# EAGLE design 8_output_sense_mux_half (EAGLE 6.5.0)
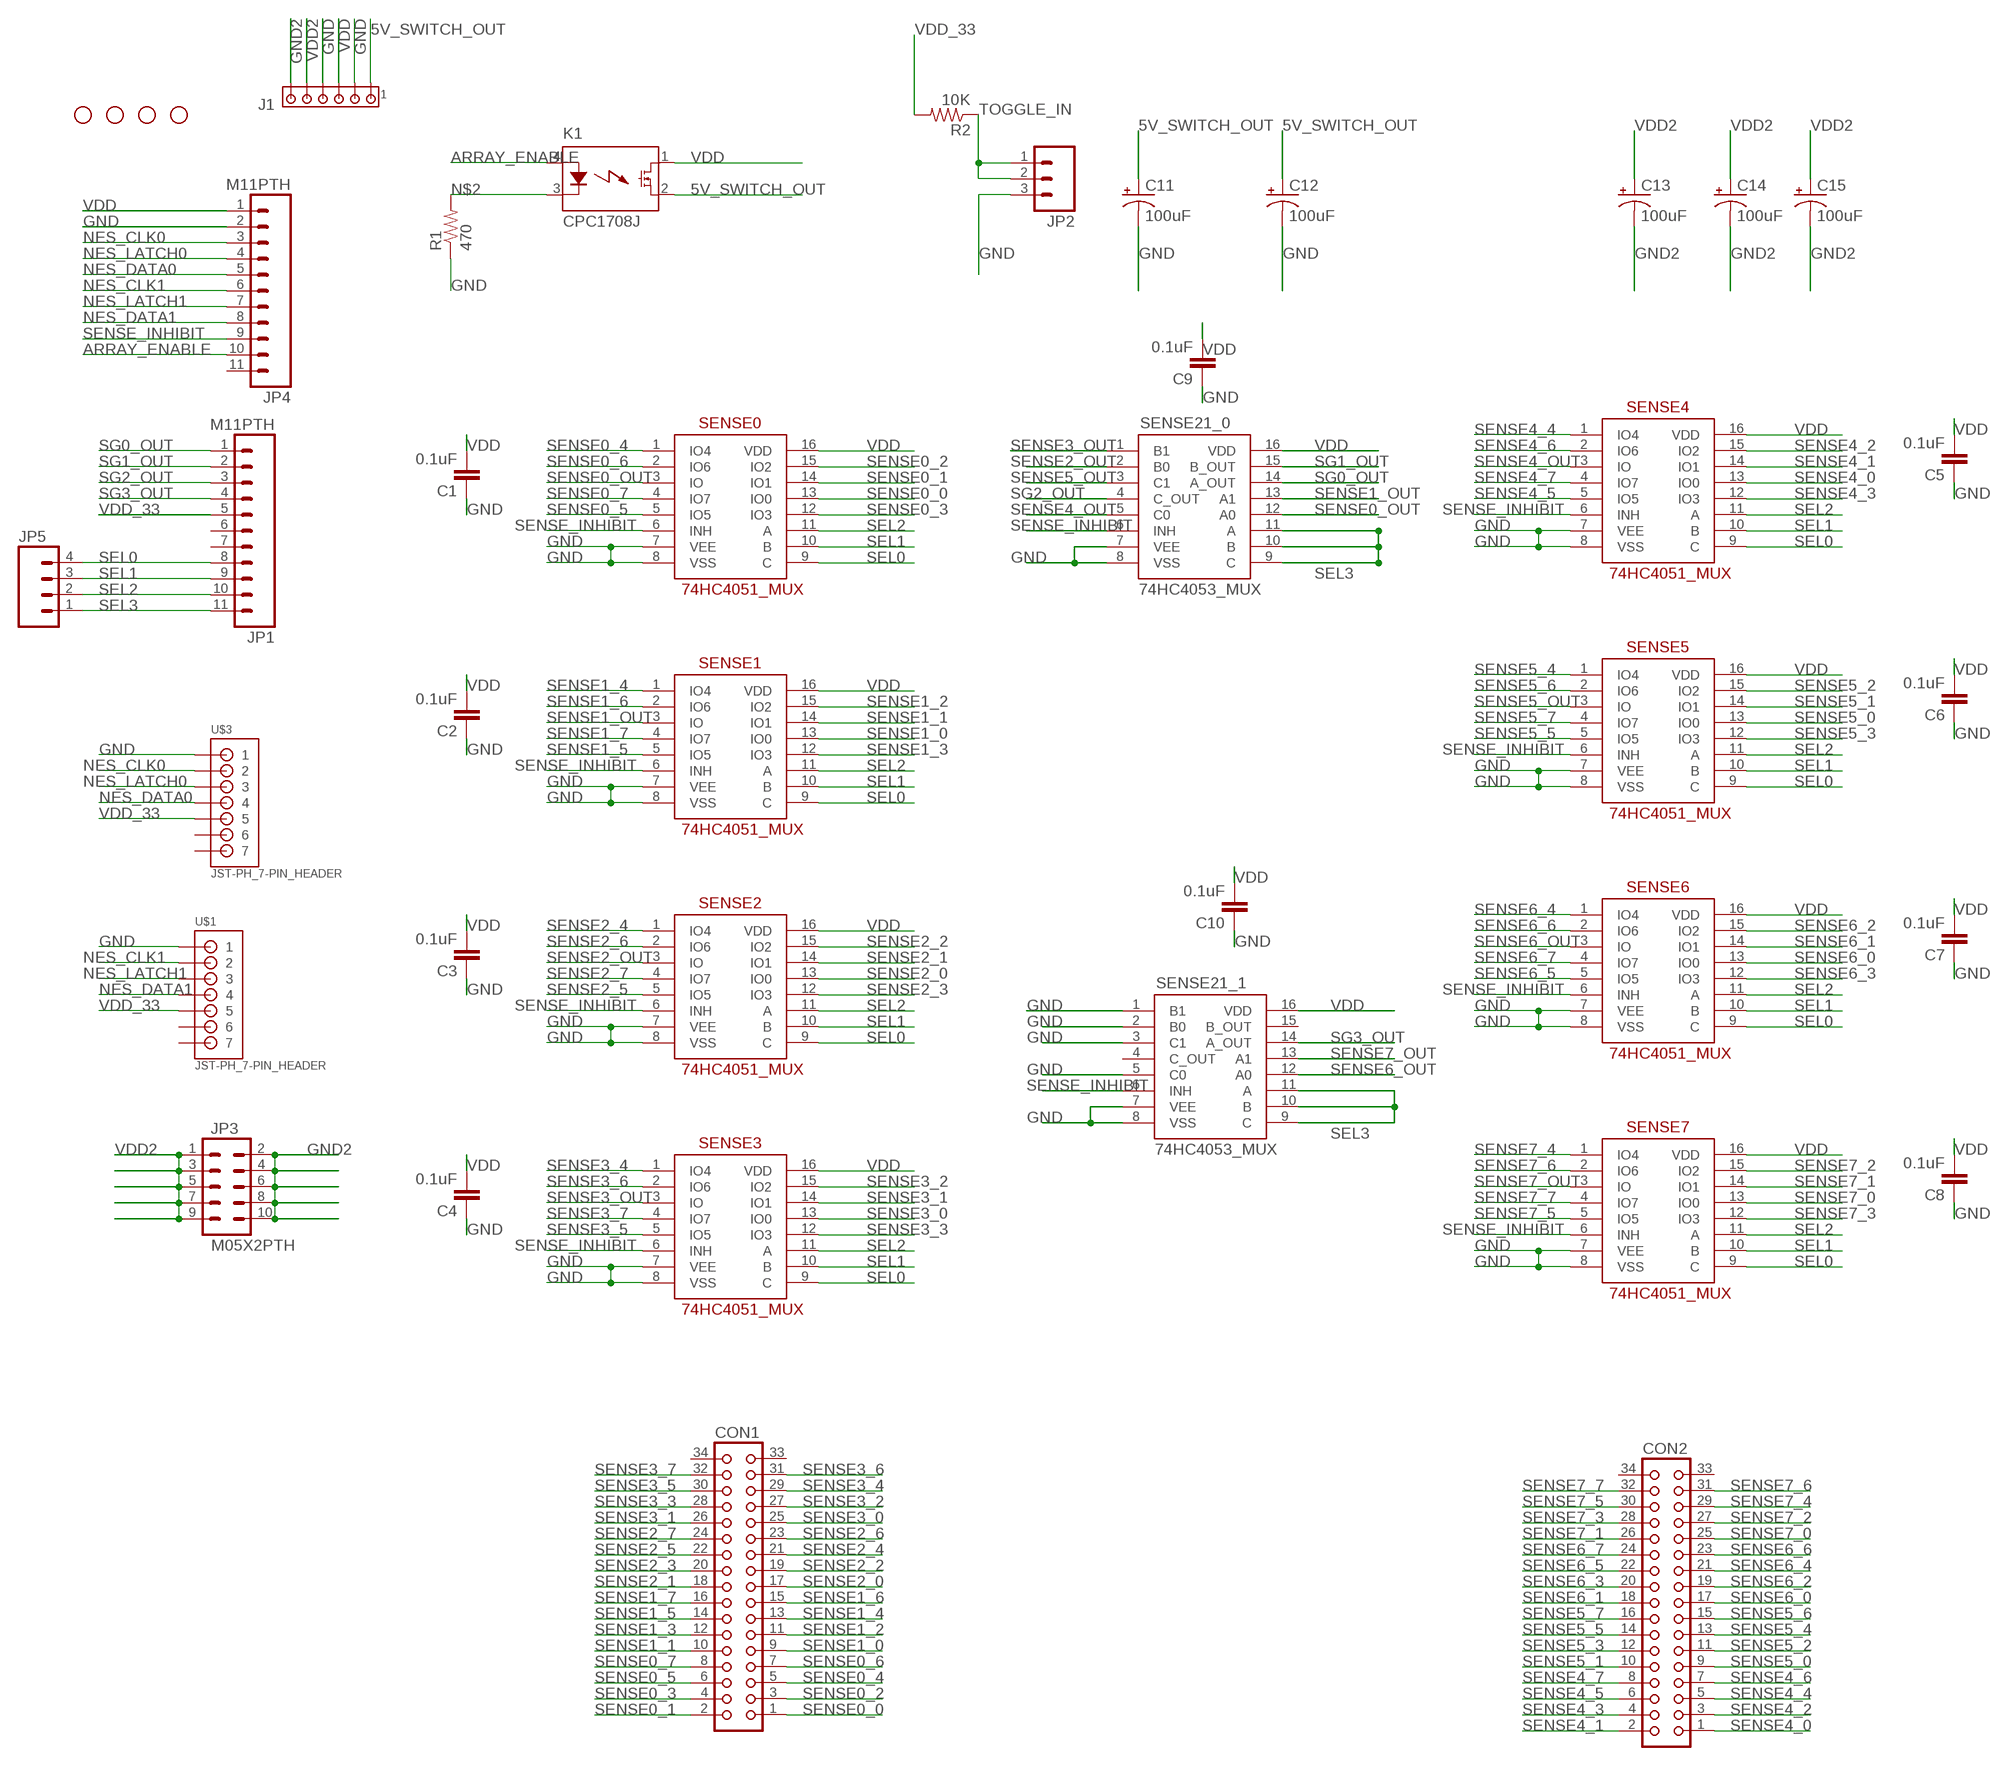
[diagram p0: schematic, sheet 1]

## Parts
C1  0.1uF  C2,5-3  [C2.5-3]
C2  0.1uF  C2,5-3  [C2.5-3]
C3  0.1uF  C2,5-3  [C2.5-3]
C4  0.1uF  C2,5-3  [C2.5-3]
C5  0.1uF  C2,5-3  [C2.5-3]
C6  0.1uF  C2,5-3  [C2.5-3]
C7  0.1uF  C2,5-3  [C2.5-3]
C8  0.1uF  C2,5-3  [C2.5-3]
C9  0.1uF  C2,5-3  [C2.5-3]
C10  0.1uF  C2,5-3  [C2.5-3]
C11  100uF  CAP_POLPTH1  [CPOL-RADIAL-100UF-25V]
C12  100uF  CAP_POLPTH1  [CPOL-RADIAL-100UF-25V]
C13  100uF  CAP_POLPTH1  [CPOL-RADIAL-100UF-25V]
C14  100uF  CAP_POLPTH1  [CPOL-RADIAL-100UF-25V]
C15  100uF  CAP_POLPTH1  [CPOL-RADIAL-100UF-25V]
CON1  CON34  [CON34]
CON2  CON34  [CON34]
J1  MTA06-156  [1X6MTA]
JP1  M11PTH  [1X11]
JP2  M03PTH  [1X03]
JP3  M05X2PTH  [AVR_ICSP]
JP4  M11PTH  [1X11]
JP5  M04PTH  [1X04]
K1  CPC1708J  [I4-PAC]
R1  470  10KOHM1/6W5%(PTH)KIT  [AXIAL-0.3-KIT]
R2  10K  10KOHM1/6W5%(PTH)KIT  [AXIAL-0.3-KIT]
SENSE0  74HC4051_MUX  [DIL16]
SENSE1  74HC4051_MUX  [DIL16]
SENSE2  74HC4051_MUX  [DIL16]
SENSE3  74HC4051_MUX  [DIL16]
SENSE4  74HC4051_MUX  [DIL16]
SENSE5  74HC4051_MUX  [DIL16]
SENSE6  74HC4051_MUX  [DIL16]
SENSE7  74HC4051_MUX  [DIL16]
SENSE21_0  74HC4053_MUX  [DIL16]
SENSE21_1  74HC4053_MUX  [DIL16]
STANDOFF1  STAND-OFF  [STAND-OFF]
STANDOFF2  STAND-OFF  [STAND-OFF]
STANDOFF3  STAND-OFF  [STAND-OFF]
STANDOFF4  STAND-OFF  [STAND-OFF]
U$1  JST-PH_7-PIN_HEADER  [JST_B7B-PH_HEADER]
U$3  JST-PH_7-PIN_HEADER  [JST_B7B-PH_HEADER]

## Nets
5V_SWITCH_OUT [PWR/GND]: C11.1(+) C12.1(+) J1.1 K1.2(DS2)
ARRAY_ENABLE: JP4.10 K1.4(A)
GND [PWR/GND]: C1.1 C2.1 C3.1 C4.1 C5.1 C6.1 C7.1 C8.1 C9.1 C10.1 C11.2(-) C12.2(-) J1.2 J1.4 JP2.3 JP4.2 R1.P$1 SENSE0.7(VEE) SENSE0.8(VSS) SENSE1.7(VEE) SENSE1.8(VSS) SENSE2.7(VEE) SENSE2.8(VSS) SENSE3.7(VEE) SENSE3.8(VSS) SENSE4.7(VEE) SENSE4.8(VSS) SENSE5.7(VEE) SENSE5.8(VSS) SENSE6.7(VEE) SENSE6.8(VSS) SENSE7.7(VEE) SENSE7.8(VSS) SENSE21_0.7(VEE) SENSE21_0.8(VSS) SENSE21_1.1(B1) SENSE21_1.2(B0) SENSE21_1.3(C1) SENSE21_1.5(C0) SENSE21_1.7(VEE) SENSE21_1.8(VSS) U$1.P1 U$3.P1
GND2 [PWR2]: C13.2(-) C14.2(-) C15.2(-) J1.6 JP3.2 JP3.4 JP3.6 JP3.8 JP3.10
N$2: K1.3(K) R1.P$2
NES_CLK0: JP4.3 U$3.P2
NES_CLK1: JP4.6 U$1.P2
NES_DATA0: JP4.5 U$3.P4
NES_DATA1: JP4.8 U$1.P4
NES_LATCH0: JP4.4 U$3.P3
NES_LATCH1: JP4.7 U$1.P3
SEL0: JP1.8 JP5.4 SENSE0.9(C) SENSE1.9(C) SENSE2.9(C) SENSE3.9(C) SENSE4.9(C) SENSE5.9(C) SENSE6.9(C) SENSE7.9(C)
SEL1: JP1.9 JP5.3 SENSE0.10(B) SENSE1.10(B) SENSE2.10(B) SENSE3.10(B) SENSE4.10(B) SENSE5.10(B) SENSE6.10(B) SENSE7.10(B)
SEL2: JP1.10 JP5.2 SENSE0.11(A) SENSE1.11(A) SENSE2.11(A) SENSE3.11(A) SENSE4.11(A) SENSE5.11(A) SENSE6.11(A) SENSE7.11(A)
SEL3: JP1.11 JP5.1 SENSE21_0.9(C) SENSE21_0.10(B) SENSE21_0.11(A) SENSE21_1.9(C) SENSE21_1.10(B) SENSE21_1.11(A)
SENSE0_0: CON1.1 SENSE0.13(IO0)
SENSE0_1: CON1.2 SENSE0.14(IO1)
SENSE0_2: CON1.3 SENSE0.15(IO2)
SENSE0_3: CON1.4 SENSE0.12(IO3)
SENSE0_4: CON1.5 SENSE0.1(IO4)
SENSE0_5: CON1.6 SENSE0.5(IO5)
SENSE0_6: CON1.7 SENSE0.2(IO6)
SENSE0_7: CON1.8 SENSE0.4(IO7)
SENSE0_OUT: SENSE0.3(IO) SENSE21_0.12(A0)
SENSE1_0: CON1.9 SENSE1.13(IO0)
SENSE1_1: CON1.10 SENSE1.14(IO1)
SENSE1_2: CON1.11 SENSE1.15(IO2)
SENSE1_3: CON1.12 SENSE1.12(IO3)
SENSE1_4: CON1.13 SENSE1.1(IO4)
SENSE1_5: CON1.14 SENSE1.5(IO5)
SENSE1_6: CON1.15 SENSE1.2(IO6)
SENSE1_7: CON1.16 SENSE1.4(IO7)
SENSE1_OUT: SENSE1.3(IO) SENSE21_0.13(A1)
SENSE2_0: CON1.17 SENSE2.13(IO0)
SENSE2_1: CON1.18 SENSE2.14(IO1)
SENSE2_2: CON1.19 SENSE2.15(IO2)
SENSE2_3: CON1.20 SENSE2.12(IO3)
SENSE2_4: CON1.21 SENSE2.1(IO4)
SENSE2_5: CON1.22 SENSE2.5(IO5)
SENSE2_6: CON1.23 SENSE2.2(IO6)
SENSE2_7: CON1.24 SENSE2.4(IO7)
SENSE2_OUT: SENSE2.3(IO) SENSE21_0.2(B0)
SENSE3_0: CON1.25 SENSE3.13(IO0)
SENSE3_1: CON1.26 SENSE3.14(IO1)
SENSE3_2: CON1.27 SENSE3.15(IO2)
SENSE3_3: CON1.28 SENSE3.12(IO3)
SENSE3_4: CON1.29 SENSE3.1(IO4)
SENSE3_5: CON1.30 SENSE3.5(IO5)
SENSE3_6: CON1.31 SENSE3.2(IO6)
SENSE3_7: CON1.32 SENSE3.4(IO7)
SENSE3_OUT: SENSE3.3(IO) SENSE21_0.1(B1)
SENSE4_0: CON2.1 SENSE4.13(IO0)
SENSE4_1: CON2.2 SENSE4.14(IO1)
SENSE4_2: CON2.3 SENSE4.15(IO2)
SENSE4_3: CON2.4 SENSE4.12(IO3)
SENSE4_4: CON2.5 SENSE4.1(IO4)
SENSE4_5: CON2.6 SENSE4.5(IO5)
SENSE4_6: CON2.7 SENSE4.2(IO6)
SENSE4_7: CON2.8 SENSE4.4(IO7)
SENSE4_OUT: SENSE4.3(IO) SENSE21_0.5(C0)
SENSE5_0: CON2.9 SENSE5.13(IO0)
SENSE5_1: CON2.10 SENSE5.14(IO1)
SENSE5_2: CON2.11 SENSE5.15(IO2)
SENSE5_3: CON2.12 SENSE5.12(IO3)
SENSE5_4: CON2.13 SENSE5.1(IO4)
SENSE5_5: CON2.14 SENSE5.5(IO5)
SENSE5_6: CON2.15 SENSE5.2(IO6)
SENSE5_7: CON2.16 SENSE5.4(IO7)
SENSE5_OUT: SENSE5.3(IO) SENSE21_0.3(C1)
SENSE6_0: CON2.17 SENSE6.13(IO0)
SENSE6_1: CON2.18 SENSE6.14(IO1)
SENSE6_2: CON2.19 SENSE6.15(IO2)
SENSE6_3: CON2.20 SENSE6.12(IO3)
SENSE6_4: CON2.21 SENSE6.1(IO4)
SENSE6_5: CON2.22 SENSE6.5(IO5)
SENSE6_6: CON2.23 SENSE6.2(IO6)
SENSE6_7: CON2.24 SENSE6.4(IO7)
SENSE6_OUT: SENSE6.3(IO) SENSE21_1.12(A0)
SENSE7_0: CON2.25 SENSE7.13(IO0)
SENSE7_1: CON2.26 SENSE7.14(IO1)
SENSE7_2: CON2.27 SENSE7.15(IO2)
SENSE7_3: CON2.28 SENSE7.12(IO3)
SENSE7_4: CON2.29 SENSE7.1(IO4)
SENSE7_5: CON2.30 SENSE7.5(IO5)
SENSE7_6: CON2.31 SENSE7.2(IO6)
SENSE7_7: CON2.32 SENSE7.4(IO7)
SENSE7_OUT: SENSE7.3(IO) SENSE21_1.13(A1)
SENSE_INHIBIT: JP4.9 SENSE0.6(INH) SENSE1.6(INH) SENSE2.6(INH) SENSE3.6(INH) SENSE4.6(INH) SENSE5.6(INH) SENSE6.6(INH) SENSE7.6(INH) SENSE21_0.6(INH) SENSE21_1.6(INH)
SG0_OUT: JP1.1 SENSE21_0.14(A_OUT)
SG1_OUT: JP1.2 SENSE21_0.15(B_OUT)
SG2_OUT: JP1.3 SENSE21_0.4(C_OUT)
SG3_OUT: JP1.4 SENSE21_1.14(A_OUT)
TOGGLE_IN: JP2.1 JP2.2 R2.P$1
VDD [PWR/GND]: C1.2 C2.2 C3.2 C4.2 C5.2 C6.2 C7.2 C8.2 C9.2 C10.2 J1.3 JP4.1 K1.1(DS1) SENSE0.16(VDD) SENSE1.16(VDD) SENSE2.16(VDD) SENSE3.16(VDD) SENSE4.16(VDD) SENSE5.16(VDD) SENSE6.16(VDD) SENSE7.16(VDD) SENSE21_0.16(VDD) SENSE21_1.16(VDD)
VDD2 [PWR2]: C13.1(+) C14.1(+) C15.1(+) J1.5 JP3.1 JP3.3 JP3.5 JP3.7 JP3.9
VDD_33 [PWR/GND]: JP1.5 R2.P$2 U$1.P5 U$3.P5
Unconnected: CON1.33 CON1.34 CON2.33 CON2.34 JP1.6 JP1.7 JP4.11 SENSE21_1.4(C_OUT) SENSE21_1.15(B_OUT) U$1.P6 U$1.P7 U$3.P6 U$3.P7

## Library data of the parts
C1-C10 = capacitor-wima:C: CAPACITOR naming: grid - package width
C11-C15 = SparkFun-Capacitors:CAP_POL: Capacitor Polarized These are standard SMD and PTH capacitors. Normally 10uF, 47uF, and 100uF in electrolytic and tantalum varieties. Always verify the external diameter of the through hole cap, it varies with capacity, voltage, and manufacturer. The EIA devices should be standard.
CON1 CON2 = con-harting:CON34: CONNECTOR; OC_FARNELL: unknown; OC_NEWARK: unknown
J1 = con-amp:MTA06-156: AMP connector
JP1 JP4 = SparkFun-Connectors:M11: Header 11 Standard 11-pin 0.1" header. Use with straight break away headers (SKU : PRT-00116), right angle break away headers (PRT-00553), swiss pins (PRT-00743), machine pins (PRT-00117), and female headers (PRT-00115).
JP2 = SparkFun-Connectors:M03: Header 3 Standard 3-pin 0.1" header. Use with straight break away headers (SKU : PRT-00116), right angle break away headers (PRT-00553), swiss pins (PRT-00743), machine pins (PRT-00117), and female headers (PRT-00115). Molex polarized connector foot print use with SKU : PRT-08232 with associated crimp pins and housings.
JP3 = SparkFun-Connectors:M05X2: Header 5x2 Standard 10-pin dual row 0.1" header. Commonly used with AVR-ISP. Use with Spark Fun Electronics SKU: PRT-00778
JP5 = SparkFun-Connectors:M04: Header 4 Standard 4-pin 0.1" header. Use with straight break away headers (SKU : PRT-00116), right angle break away headers (PRT-00553), swiss pins (PRT-00743), machine pins (PRT-00117), and female headers (PRT-00115). Molex polarized connector foot print use with SKU : PRT-08231 with associated crimp pins and housings. 1MM SMD Version SKU: PRT-10208
K1 = relay:CPC1708J: Single-Pole, Normally Open i4-PAC (TM) DC Power Relay Source: Data sheet <http://www.clare.com/home/pdfs.nsf/www/CPC1708.pdf/$file/CPC1708.pdf>
R1 R2 = SparkFun-Resistors:10KOHM1/6W5%(PTH): RES-08375; PROD_ID: RES-08375
SENSE0 SENSE1-SENSE7 = MBI:74HC4051_MUX: 8:1 analog mux
SENSE21_0 SENSE21_1 = MBI:74HC4053_MUX: 3 channel 2:1 analog mux
STANDOFF1-STANDOFF4 = SparkFun-Electromechanical:STAND-OFF: #4 Stand Off This is the mechanical footprint for a #4 phillips button head screw. Use the keepout ring to avoid running the screw head into surrounding components. SKU : PRT-00447
U$1 U$3 = SJH:JST-PH_7-PIN_HEADER: 7-pin JST PH Shrouded Header top entry P/N B7B-PH-K-S Mating connector PHR-7

## Net classes
1 PWR/GND: width 0.61 mm
2 PWR2: width 0.813 mm

## Board
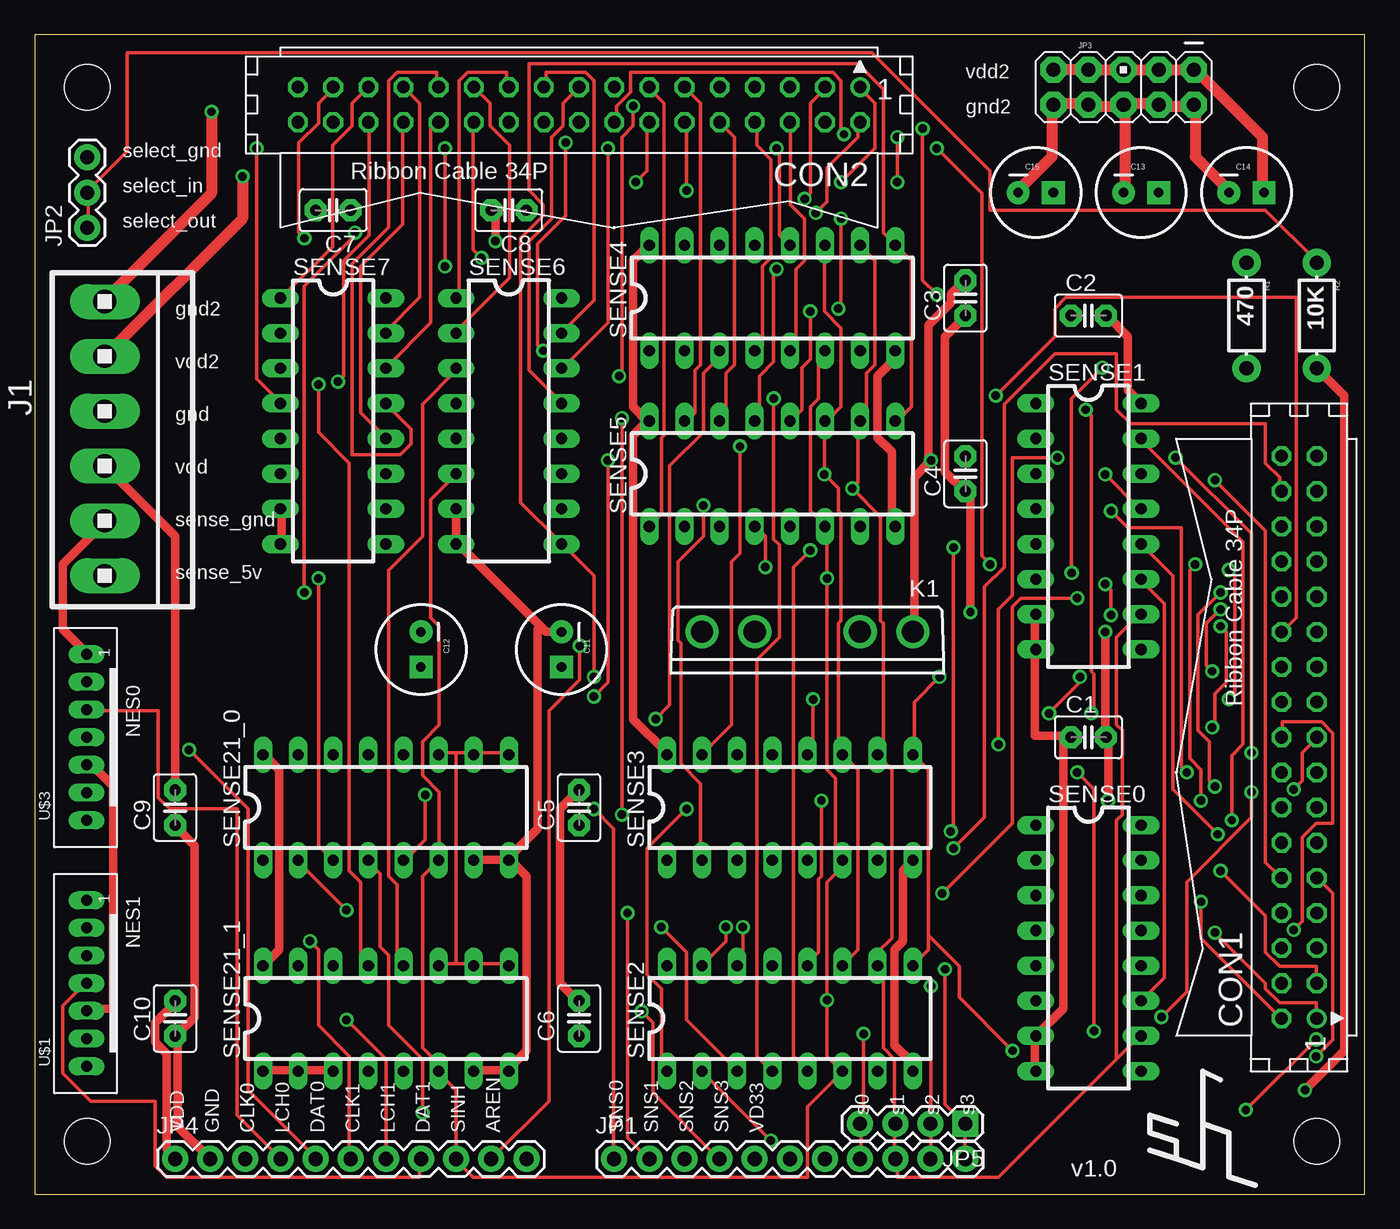
[diagram p1: board, top side]
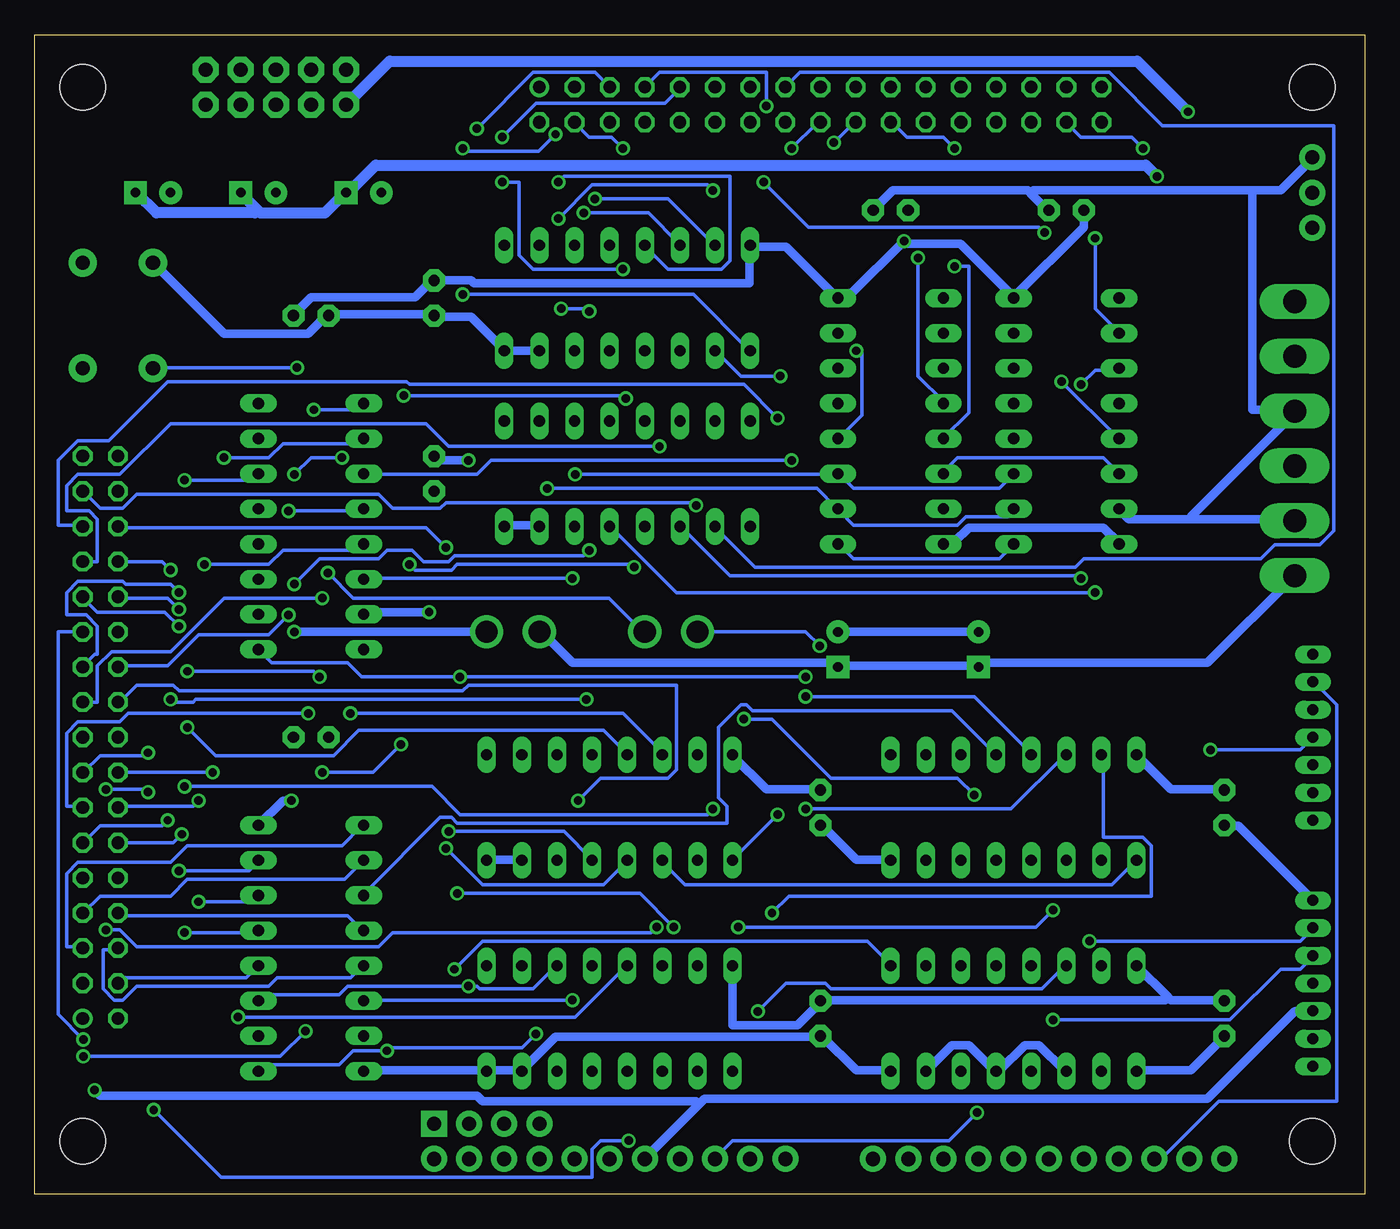
[diagram p2: board, bottom side, seen from below]

Size 96.19 x 83.81 mm. Coordinates in mm from the lower left corner, seen from the top.
Outline: 0,0 96.19,0 96.19,83.81 0,83.81 0,0
Copper layers (1*16): Top 0.035mm / dielectric 1.5mm / Bottom 0.035mm
Design rules "default": minimum track width 10mil, minimum drill 24mil, track to track 8mil, track to pad 8mil, pad to pad 8mil, via to via 8mil, smd to smd 8mil, copper to edge 40mil, drill to drill 8mil, minimum pad ring 10mil, minimum via ring 8mil, stop-mask expansion 4mil, vias tented up to drill 0mil, thermal gap 10mil

### Footprints (pad centres in the part's own frame; a part is rotated, then mirrored left to right if it is on the bottom)
C2.5-3 = drill 0.813 pad 1.6 octagon: 1 -1.27,0; 2 1.27,0
CPOL-RADIAL-100UF-25V = drill 0.7 pad 1.651 square: 1 1.27,0 | drill 0.7 pad 1.651: 2 -1.27,0
CON34 = drill 0.914: 1 -20.32,-1.27 | drill 0.914 octagon: 2 -20.32,1.27; 3 -17.78,-1.27; 4 -17.78,1.27; 5 -15.24,-1.27; 6 -15.24,1.27; 7 -12.7,-1.27; 8 -12.7,1.27; 9 -10.16,-1.27; 10 -10.16,1.27; 11 -7.62,-1.27; 12 -7.62,1.27; 13 -5.08,-1.27; 14 -5.08,1.27; 15 -2.54,-1.27; 16 -2.54,1.27; 17 0,-1.27; 18 0,1.27; 19 2.54,-1.27; 20 2.54,1.27; 21 5.08,-1.27; 22 5.08,1.27; 23 7.62,-1.27; 24 7.62,1.27; 25 10.16,-1.27; 26 10.16,1.27; 27 12.7,-1.27; 28 12.7,1.27; 29 15.24,-1.27; 30 15.24,1.27; 31 17.78,-1.27; 32 17.78,1.27; 33 20.32,-1.27; 34 20.32,1.27
1X6MTA = drill 1.676 long: 1 9.906,0; 2 5.944,0; 3 1.981,0; 4 -1.981,0; 5 -5.944,0; 6 -9.906,0
1X11 = drill 1.016 pad 1.88: 1 0,0; 2 2.54,0; 3 5.08,0; 4 7.62,0; 5 10.16,0; 6 12.7,0; 7 15.24,0; 8 17.78,0; 9 20.32,0; 10 22.86,0; 11 25.4,0
1X03 = drill 1.016 pad 1.88: 1 0,0; 2 2.54,0; 3 5.08,0
AVR_ICSP = drill 1.016 pad 1.88 octagon: 1 -1.27,5.08; 2 1.27,5.08; 3 -1.27,2.54; 4 1.27,2.54; 5 -1.27,0; 6 1.27,0; 7 -1.27,-2.54; 8 1.27,-2.54; 9 -1.27,-5.08; 10 1.27,-5.08
1X04 = drill 1.016 pad 1.88 square: 1 0,0 | drill 1.016 pad 1.88: 2 2.54,0; 3 5.08,0; 4 7.62,0
I4-PAC = drill 1.6 pad 2.3: 1 -7.62,0; 2 -3.81,0; 3 3.81,0; 4 7.62,0
AXIAL-0.3-KIT = drill 1.016 pad 2.032: P$1 -3.81,0; P$2 3.81,0
DIL16 = drill 0.813 long: 1 -8.89,-3.81; 2 -6.35,-3.81; 3 -3.81,-3.81; 4 -1.27,-3.81; 5 1.27,-3.81; 6 3.81,-3.81; 7 6.35,-3.81; 8 8.89,-3.81; 9 8.89,3.81; 10 6.35,3.81; 11 3.81,3.81; 12 1.27,3.81; 13 -1.27,3.81; 14 -3.81,3.81; 15 -6.35,3.81; 16 -8.89,3.81
STAND-OFF = hole 3.302: 0,0
JST_B7B-PH_HEADER = drill 0.8 long: P1 6,0.048; P2 4,0.048; P3 2,0.048; P4 0,0.048; P5 -2,0.048; P6 -4,0.048; P7 -6,0.048

### Placement (x,y rotation side)
C1  76.2,33.02 0 top
C2  76.2,63.5 0 top
C3  67.31,64.77 90 top
C4  67.31,52.07 90 top
C5  39.37,27.94 90 top
C6  39.37,12.7 90 top
C7  21.59,71.12 180 top
C8  34.29,71.12 180 top
C9  10.16,27.94 90 top
C10  10.16,12.7 90 top
C11  38.1,39.37 270 top
C12  27.94,39.37 270 top
C13  80.01,72.39 0 top
C14  87.63,72.39 0 top
C15  72.39,72.39 0 top
CON1  91.44,33.02 90 top
CON2  39.37,78.74 180 top
J1  5.08,54.61 270 top
JP1  41.91,2.54 0 top
JP2  3.81,69.85 90 top
JP3  78.74,80.01 270 top
JP4  10.16,2.54 0 top
JP5  67.31,5.08 180 top
K1  55.88,40.64 180 top
R1  87.63,63.5 270 top
R2  92.71,63.5 270 top
SENSE0  76.2,17.78 270 top
SENSE1  76.2,48.26 270 top
SENSE2  54.61,12.7 0 top
SENSE3  54.61,27.94 0 top
SENSE4  53.34,64.77 0 top
SENSE5  53.34,52.07 0 top
SENSE6  34.29,55.88 270 top
SENSE7  21.59,55.88 270 top
SENSE21_0  25.4,27.94 0 top
SENSE21_1  25.4,12.7 0 top
STANDOFF1  3.81,3.81 0 top
STANDOFF2  92.71,3.81 0 top
STANDOFF3  92.71,80.01 0 top
STANDOFF4  3.81,80.01 0 top
U$1  3.81,15.24 90 top
U$2  [SH]  83.82,3.81 0 top
U$3  3.81,33.02 90 top

### Tracks (layer width: path | path; a pad name or v marks a point on that pad's centre or on a via)
5V_SWITCH_OUT
  Bottom 0.61: K1.2 59.54,40.64 57.3,38.41 38.2,38.41 C11.1 38,38.2 28.04,38.2 C12.1 27.84,38.41 11.38,38.41 J1.1
ARRAY_ENABLE  (via drill 0.61)
  Top 0.254: JP4.10 37.19,6.71 37.19,34.95 39.42,37.19 v39.42,39.62
  Bottom 0.254: v39.42,39.62 40.44,40.64 K1.4
GND  (via drill 0.61)
  Top 0.61: SENSE7.8 17.88,47.14 17.88,49.38 SENSE7.7 | U$3.P1 3.66,39.22 2.03,40.84 2.03,45.52 5.08,48.56 J1.2 | SENSE21_0.7 31.9,24.18 34.14,24.18 SENSE21_0.8 | SENSE6.7 SENSE6.8 30.68,46.94 36.58,41.05 | 36.58,41.05 36.98,40.64 C11.2 | SENSE21_0.8 34.34,24.38 36.37,26.42 36.37,40.84 36.58,41.05 | SENSE5.8 62.18,48.36 61.98,48.56 61.98,53.65 60.96,54.66 60.96,59.13 62.18,60.35 62.18,60.96 SENSE4.8 | C3.1 67.26,63.4 65.84,61.98 65.84,52.22 67.26,50.8 C4.1 67.46,50.6 67.67,50.39 v67.67,42.06 | SENSE1.7 72.34,41.86 72.34,39.42 SENSE1.8 72.34,39.22 72.34,33.12 74.78,33.12 C1.1 74.37,32.92 74.37,13.41 SENSE0.7 72.34,11.38 72.34,8.94 SENSE0.8 | SENSE3.8 63.4,23.98 62.79,23.37 62.79,18.29 62.18,17.68 62.18,10.77 63.4,9.55 63.4,8.94 SENSE2.8 | SENSE21_1.7 31.9,8.94 34.14,8.94 SENSE21_1.8 34.34,9.14 35.56,10.36 35.56,22.96 34.54,23.98 SENSE21_0.8 | SENSE21_1.1 16.66,8.94 18.9,8.94 SENSE21_1.2 19.3,8.94 21.54,8.94 SENSE21_1.3 | JP4.2 10.36,4.88 10.36,11.18 10.16,11.38 C10.1 10.36,11.58 11.58,12.8 11.58,25.2 10.16,26.62 C9.1
  Bottom 0.61: 24.18,72.34 24.38,72.54 34.14,72.54 C8.1 | 24.18,72.34 22.96,71.12 C7.1 | 8.13,72.54 23.98,72.54 24.18,72.34 | 8.13,72.54 6.1,72.54 3.86,74.78 JP2.3 | 12.6,48.77 5.08,48.77 J1.2 | 12.6,48.77 17.07,48.77 17.68,49.38 SENSE7.7 | 12.6,48.77 12.6,48.97 5.08,56.49 J1.4 5.28,56.69 8.13,56.69 8.13,72.54 | C5.1 39.22,26.62 36.78,24.18 34.34,24.18 SENSE21_0.8 | C11.2 C12.2 | SENSE7.8 17.88,47.14 18.9,48.16 28.65,48.16 29.67,47.14 30.48,47.14 SENSE6.8 | SENSE5.7 59.74,48.36 62.18,48.36 SENSE5.8 | SENSE4.7 SENSE4.8 62.38,61.16 64.62,63.4 67.06,63.4 C3.1 67.46,63.6 74.78,63.6 C2.1 75.18,63.4 76.4,62.18 82.5,62.18 R1.P$1 | SENSE3.7 60.96,24.18 63.4,24.18 SENSE3.8 | SENSE0.8 72.34,8.94 63.6,8.94 SENSE2.8 63.4,8.94 60.96,8.94 SENSE2.7 60.76,9.14 58.52,11.38 39.62,11.38 C6.1 39.22,11.38 36.78,8.94 34.34,8.94 SENSE21_1.8 | SENSE21_1.7 29.87,10.77 28.65,10.77 26.82,8.94 SENSE21_1.5 26.42,8.94 24.59,10.77 23.57,10.77 21.74,8.94 SENSE21_1.3 | U$1.P1 3.86,21.34 9.14,26.62 10.16,26.62 C9.1 | C10.1 10.16,11.38 12.6,8.94 16.46,8.94 SENSE21_1.1 | v67.67,42.06 72.34,42.06 SENSE1.7
GND2  (via drill 0.61)
  Top 0.813: C14.2 86.36,72.54 83.92,74.98 83.92,78.64 JP3.2 83.52,78.64 81.48,78.64 JP3.4 81.28,78.84 79.05,78.84 JP3.6 | C13.2 78.84,72.54 78.84,78.64 JP3.6 | C15.2 71.12,72.54 73.56,74.98 73.56,78.64 JP3.10 73.97,78.84 76.2,78.84 JP3.8 76.4,78.64 78.44,78.64 JP3.6 | v12.8,78.23 12.8,72.34 5.08,64.62 J1.6
  Bottom 0.813: v12.8,78.23 16.46,81.89 70.51,81.89 JP3.10
N$2  (via drill 0.61)
  Top 0.254: v77.22,59.74 74.98,57.51 v74.98,44.91
  Bottom 0.254: v77.22,59.74 87.58,59.74 R1.P$2 | v74.98,44.91 73.15,43.08 54.66,43.08 52.22,40.64 K1.3
NES_CLK0
  Bottom 0.254: U$3.P2 3.66,36.98 2.03,35.36 2.03,6.71 10.57,6.71 14.63,2.64 15.24,2.64 JP4.3
NES_CLK1  (via drill 0.61)
  Top 0.254: v19.91,18.29 20.52,17.68 20.52,12.19 22.76,9.96 22.76,2.64 JP4.6
  Bottom 0.254: v19.91,18.29 4.67,18.29 3.86,19.1 U$1.P2
NES_DATA0  (via drill 0.61)
  Top 0.254: v11.18,32.11 15.44,27.84 15.44,7.52 20.32,2.64 JP4.5
  Bottom 0.254: v11.18,32.11 4.67,32.11 3.86,32.92 U$3.P4
NES_DATA1
  Top 0.254: U$1.P4 3.66,15.24 2.03,13.61 2.03,8.74 4.06,6.71 8.74,6.71 8.74,2.03 9.55,1.22 27.84,1.22 27.84,2.44 JP4.8
NES_LATCH0
  Top 0.254: JP4.4 14.63,5.69 14.63,27.84 9.75,27.84 8.94,28.65 8.94,34.95 3.86,34.95 U$3.P3
NES_LATCH1  (via drill 0.61)
  Top 0.254: v22.55,12.6 25.4,9.75 JP4.7
  Bottom 0.254: v22.55,12.6 9.75,12.6 6.1,16.26 4.67,16.26 3.86,17.07 U$1.P3
SEL0  (via drill 0.61)
  Top 0.254: SENSE5.9 62.38,55.88 63.4,56.9 63.4,67.46 62.38,68.48 SENSE4.9 62.18,68.68 61.37,69.49 61.37,79.86 59.54,81.69 35.76,81.69 35.76,72.54 36.78,71.53 36.78,70.71 35.15,69.09 35.15,49.99 38,47.14 SENSE6.9 38.2,46.94 40.44,44.7 v40.44,37.39 | 59.74,5.08 59.74,2.64 JP1.8 | 64.62,18.69 64.62,30.68 63.6,31.7 SENSE3.9 63.6,31.9 63.6,35.56 v65.43,37.39 | 64.62,18.69 64.62,17.68 63.6,16.66 SENSE2.9 | v70.71,10.36 66.85,14.22 66.85,16.46 64.62,18.69 | 59.74,5.08 59.94,5.28 v59.94,11.58 | 59.74,5.08 JP5.4
  Bottom 0.254: SENSE7.9 25.4,46.94 26.42,45.92 36.98,45.92 38,46.94 SENSE6.9 | SENSE0.9 79.86,8.94 79.45,9.35 74.17,9.35 73.15,10.36 v70.71,10.36 70.51,10.57 60.96,10.57 v59.94,11.58 | SENSE1.9 79.05,38.41 73.56,38.41 72.54,37.39 v65.43,37.39 v40.44,37.39
SEL1  (via drill 0.61)
  Top 0.254: SENSE4.10 59.74,68.48 60.76,67.46 60.76,59.94 60.15,59.33 60.15,56.29 59.74,55.88 SENSE5.10 59.54,55.88 59.54,51.41 v59.13,51 61.16,48.97 61.16,41.45 61.37,41.25 61.37,31.29 | 62.18,5.08 62.18,9.75 61.37,10.57 61.37,16.05 60.96,16.46 SENSE2.10 60.96,17.48 61.98,18.49 61.98,30.68 61.37,31.29 | 61.37,31.29 60.96,31.7 SENSE3.10 61.37,31.29 | 78.23,9.75 69.7,1.22 62.38,1.22 62.38,2.44 JP1.9 62.18,2.64 62.18,5.08 | 78.23,9.75 79.86,11.38 SENSE0.10 | 78.23,9.75 78.23,27.03 78.64,27.43 78.64,33.53 78.23,33.93 78.23,40.23 79.86,41.86 SENSE1.10 | 62.18,5.08 JP5.3
  Bottom 0.254: SENSE7.10 25.4,49.38 25.81,48.97 28.85,48.97 29.46,48.36 36.98,48.36 38,49.38 SENSE6.10 38.2,49.58 39.62,51 v59.13,51
SEL2  (via drill 0.61)
  Top 0.254: SENSE4.11 57.1,68.48 57.1,63.8 58.32,62.59 58.32,56.9 57.3,55.88 SENSE5.11 57.1,55.88 v57.1,52.02 58.12,51 58.12,49.38 58.32,49.17 58.32,41.45 58.12,41.25 58.12,32.11 58.32,31.9 SENSE3.11 58.52,31.7 59.54,30.68 59.54,17.68 58.52,16.66 SENSE2.11 | 64.82,5.08 64.82,2.64 JP1.10 | SENSE0.11 81.69,15.65 81.69,42.67 80.06,44.3 SENSE1.11 | v64.82,15.04 64.82,5.08 | 64.82,5.08 JP5.2
  Bottom 0.254: SENSE7.11 25.4,52.02 26.42,51 36.98,51 38,52.02 SENSE6.11 38.2,52.02 v57.1,52.02 | SENSE0.11 79.86,14.02 79.45,14.43 74.17,14.43 73.56,15.04 v64.82,15.04 64.21,15.04 64.01,14.83 60.15,14.83 58.52,16.46 SENSE2.11
SEL3  (via drill 0.61)
  Top 0.254: 67.26,5.08 67.26,2.64 JP1.11 | 30.48,16.66 31.7,16.66 SENSE21_1.10 31.9,16.66 34.14,16.66 SENSE21_1.9 | 30.48,16.66 29.26,16.66 SENSE21_1.11 | 30.48,31.9 31.7,31.9 SENSE21_0.10 31.9,31.9 34.14,31.9 SENSE21_0.9 | 30.48,31.9 29.26,31.9 SENSE21_0.11 | 30.48,31.9 30.48,16.66 | 67.26,5.08 65.84,6.5 v65.84,16.26 | 67.26,5.08 JP5.1
  Bottom 0.254: v65.84,16.26 63.8,18.29 35.97,18.29 34.34,16.66 SENSE21_1.9
SENSE0_0  (via drill 0.61)
  Top 0.254: v85.34,18.9 89,15.24 89,14.83 90.02,13.82 92.66,13.82 92.66,12.8 CON1.1
  Bottom 0.254: v85.34,18.9 80.06,18.9 SENSE0.13
SENSE0_1  (via drill 0.61)
  Top 0.254: v84.33,21.13 84.33,18.49 90.02,12.8 CON1.2
  Bottom 0.254: SENSE0.14 80.47,21.13 v84.33,21.13
SENSE0_2  (via drill 0.61)
  Top 0.254: v85.75,23.37 89,20.12 89,17.48 90.02,16.46 92.66,16.46 92.66,15.24 CON1.3
  Bottom 0.254: v85.75,23.37 80.67,23.37 80.06,23.98 SENSE0.15
SENSE0_3
  Bottom 0.254: SENSE0.12 80.87,15.65 89.61,15.65 90.02,15.24 CON1.4
SENSE0_4
  Bottom 0.254: SENSE0.1 72.54,26.62 73.97,25.2 85.14,25.2 86.36,23.98 93.07,23.98 93.88,23.16 93.88,17.88 92.86,17.88 CON1.5
SENSE0_5
  Bottom 0.254: SENSE0.5 72.54,16.46 73.36,15.65 78.64,15.65 79.25,15.04 88.8,15.04 89.81,14.02 90.42,14.02 91.24,14.83 91.24,17.68 90.22,17.68 CON1.6
SENSE0_6
  Bottom 0.254: SENSE0.2 73.76,22.76 85.14,22.76 86.36,21.54 91.44,21.54 92.66,20.32 CON1.7
SENSE0_7
  Bottom 0.254: SENSE0.4 72.54,19.1 73.56,20.12 89.81,20.12 90.02,20.32 CON1.8
SENSE0_OUT
  Bottom 0.254: SENSE21_0.12 29.87,34.95 44.3,34.95 44.7,35.36 45.11,35.36 46.74,33.73 46.74,28.65 46.13,28.04 46.13,26.82 65.63,26.82 66.04,27.23 66.85,27.23 72.34,21.74 SENSE0.3
SENSE1_0  (via drill 0.61)
  Top 0.254: v77.42,52.02 79.86,49.58 SENSE1.13 | v73.97,53.24 70.71,53.24 70.71,43.28 69.7,42.27 v69.7,32.51 | v75.39,30.48 76.61,29.26 v76.61,11.79 | v92.66,9.96 93.88,11.18 93.88,21.74 92.86,22.76 CON1.9
  Bottom 0.254: v77.42,52.02 76.2,53.24 v73.97,53.24 | v69.7,32.51 71.73,30.48 v75.39,30.48 | v76.61,11.79 78.44,9.96 v92.66,9.96
SENSE1_1  (via drill 0.61)
  Top 0.254: v85.34,51.61 89,47.95 89,23.98 90.02,22.96 CON1.10
  Bottom 0.254: SENSE1.14 80.47,51.61 v85.34,51.61
SENSE1_2  (via drill 0.61)
  Top 0.254: v86.56,27.03 86.56,31.7 87.38,32.51 87.38,47.14 80.06,54.46 SENSE1.15
  Bottom 0.254: v86.56,27.03 86.97,26.62 91.44,26.62 92.66,25.4 CON1.11
SENSE1_3  (via drill 0.61)
  Top 0.254: SENSE1.12 82.3,44.7 82.3,29.26 v85.55,26.01
  Bottom 0.254: v85.55,26.01 86.16,25.4 CON1.12
SENSE1_4  (via drill 0.61)
  Top 0.254: v76,56.69 76.4,56.29 76.4,37.8 76.61,37.59 76.61,34.95 v76.4,34.75
  Bottom 0.254: v76,56.69 72.95,56.69 72.54,57.1 SENSE1.1 | v76.4,34.75 89.41,34.75 90.02,34.14 93.07,34.14 93.88,33.33 93.88,28.04 92.86,28.04 CON1.13
SENSE1_5  (via drill 0.61)
  Top 0.254: v83.92,45.52 83.52,45.11 83.52,31.5 84.33,30.68 v84.33,28.45
  Bottom 0.254: v83.92,45.52 79.25,45.52 78.23,46.53 72.95,46.53 72.54,46.94 SENSE1.5 | v84.33,28.45 84.73,28.04 90.02,28.04 CON1.14
SENSE1_6  (via drill 0.61)
  Top 0.254: v82.5,53.24 87.99,47.75 v87.99,31.9
  Bottom 0.254: SENSE1.2 72.75,54.25 78.23,54.25 79.25,53.24 v82.5,53.24 | v87.99,31.9 88.19,31.7 91.44,31.7 92.66,30.48 CON1.15
SENSE1_7  (via drill 0.61)
  Top 0.254: v77.83,49.38 79.05,48.16 82.91,48.16 82.91,30.89 v83.31,30.48
  Bottom 0.254: v77.83,49.38 72.54,49.38 SENSE1.4 | CON1.16 v83.31,30.48
SENSE1_OUT  (via drill 0.61)
  Top 0.254: v40.44,35.97 41.45,36.98 v41.45,53.03
  Bottom 0.254: v40.44,35.97 28.25,35.97 24.18,31.9 SENSE21_0.13 | v41.45,53.03 63.2,53.03 64.21,52.02 72.34,52.02 SENSE1.3
SENSE2_0  (via drill 0.61)
  Top 0.254: v81.48,12.8 83.31,14.63 83.31,22.55 87.99,27.23 v87.99,29.06 | v91.03,29.26 91.64,29.87 91.64,31.9 92.66,32.92 CON1.17
  Bottom 0.254: v81.48,12.8 57.1,12.8 53.44,16.46 SENSE2.13 | v87.99,29.06 88.19,29.26 v91.03,29.26
SENSE2_1  (via drill 0.61)
  Top 0.254: v51.21,19.3 51.21,17.07 50.8,16.66 SENSE2.14 | v91.03,19.1 91.64,19.71 91.64,25.81 92.66,26.82 93.88,26.82 93.88,33.33 93.07,34.14 90.22,34.14 90.22,33.12 CON1.18
  Bottom 0.254: v51.21,19.3 51.61,18.9 70.31,18.9 71.32,17.88 88.8,17.88 90.02,19.1 v91.03,19.1
SENSE2_2  (via drill 0.61)
  Top 0.254: v49.99,19.3 49.99,18.29 48.36,16.66 SENSE2.15 | v65.63,21.74 70.71,26.82 70.71,42.47 71.32,43.08 v75.39,43.08
  Bottom 0.254: v49.99,19.3 52.43,21.74 v65.63,21.74 | v75.39,43.08 82.5,43.08 86.36,39.22 90.63,39.22 91.64,38.2 91.64,35.56 CON1.19
SENSE2_3  (via drill 0.61)
  Top 0.254: v56.9,28.45 56.9,22.96 56.69,22.76 56.69,17.48 55.88,16.66 SENSE2.12
  Bottom 0.254: v56.9,28.45 55.27,30.07 50.39,30.07 49.78,30.68 49.78,36.78 64.82,36.78 65.23,36.37 85.75,36.37 86.16,36.78 88.8,36.78 90.02,35.56 CON1.20
SENSE2_4  (via drill 0.61)
  Top 0.254: v47.14,27.84 44.3,24.99 44.3,15.85 45.31,14.83 45.31,9.35 45.72,8.94 SENSE2.1 | v85.34,29.46 84.94,29.87 84.94,32.72 84.12,33.53 84.12,41.86 v85.75,43.48
  Bottom 0.254: v47.14,27.84 47.55,27.43 65.43,27.43 67.46,29.46 v85.34,29.46 | v85.75,43.48 86.36,44.09 89.61,44.09 89.81,44.3 93.07,44.3 93.88,43.48 93.88,41.86 92.46,41.86 91.64,41.05 91.64,39.01 91.85,39.01 92.66,38.2 CON1.21
SENSE2_5  (via drill 0.61)
  Top 0.254: v56.08,46.53 54.86,45.31 54.86,9.96 55.88,8.94 SENSE2.5 | v77.42,44.09 77.83,43.69 v77.83,41.86
  Bottom 0.254: v56.08,46.53 56.49,46.13 65.84,46.13 66.24,45.72 68.07,45.72 68.89,46.53 70.71,46.53 71.32,45.92 75.59,45.92 v77.42,44.09 | v77.83,41.86 79.25,40.44 84.33,40.44 86.56,38.2 90.02,38.2 CON1.22
SENSE2_6  (via drill 0.61)
  Top 0.254: v53.24,3.86 48.36,8.74 SENSE2.2 | v92.66,11.18 v87.58,6.1
  Bottom 0.254: v53.24,3.86 55.27,3.86 55.88,3.25 55.88,1.22 82.7,1.22 v87.58,6.1 | v92.66,11.18 94.49,13.01 94.49,40.64 CON1.23
SENSE2_7  (via drill 0.61)
  Top 0.254: v53.44,57.51 53.44,47.35 53.85,46.94 53.85,40.23 52.22,38.61 52.22,9.96 53.24,8.94 SENSE2.4 | v69.49,57.71 73.76,61.98 73.76,64.01 74.57,64.82 91.24,64.82 91.24,41.66 90.22,40.64 CON1.24
  Bottom 0.254: v53.44,57.51 53.65,57.71 v69.49,57.71
SENSE2_OUT  (via drill 0.61)
  Top 0.254: v22.55,20.52 19.1,23.98 SENSE21_0.2 | v45.31,19.3 47.14,17.48 47.14,12.6 50.8,8.94 SENSE2.3
  Bottom 0.254: v22.55,20.52 23.77,19.3 v45.31,19.3
SENSE3_0  (via drill 0.61)
  Top 0.254: v85.14,33.73 85.34,33.93 85.34,36.17 86.16,36.98 86.16,40.64 v85.75,41.05
  Bottom 0.254: v85.14,33.73 83.11,31.7 74.57,31.7 72.75,33.53 55.07,33.53 53.44,31.9 SENSE3.13 | v85.75,41.05 86.77,42.06 91.64,42.06 92.66,43.08 CON1.25
SENSE3_1  (via drill 0.61)
  Top 0.254: v73.36,34.75 75.59,36.98 v75.59,37.39 | v85.14,37.8 84.73,38.2 84.73,41.25 v85.75,42.27
  Bottom 0.254: v73.36,34.75 53.65,34.75 50.8,31.9 SENSE3.14 | v75.59,37.39 76,37.8 v85.14,37.8 | v85.75,42.27 86.56,43.08 90.02,43.08 CON1.26
SENSE3_2  (via drill 0.61)
  Top 0.254: v51,54.05 51,46.33 50.39,45.72 50.39,33.93 48.36,31.9 SENSE3.15
  Bottom 0.254: v51,54.05 66.24,54.05 67.87,55.68 86.36,55.68 90.02,52.02 93.07,52.02 93.88,51.21 93.88,49.38 92.25,49.38 91.64,48.77 91.64,45.72 CON1.27
SENSE3_3  (via drill 0.61)
  Top 0.254: v56.29,35.76 56.29,32.31 55.88,31.9 SENSE3.12 | v86.36,35.76 86.77,36.17 86.77,44.7 v86.36,45.11
  Bottom 0.254: v56.29,35.76 84.53,35.76 84.73,35.56 86.16,35.56 v86.36,35.76 | v86.36,45.11 86.97,45.72 CON1.28
SENSE3_4  (via drill 0.61)
  Top 0.254: v42.47,56.08 v42.47,27.43
  Bottom 0.254: v42.47,27.43 45.72,24.18 SENSE3.1 | v42.47,56.08 44.91,58.52 69.09,58.52 69.29,58.73 86.56,58.73 90.83,54.46 93.07,54.46 94.49,53.03 94.49,48.36 92.86,48.36 CON1.29
SENSE3_5  (via drill 0.61)
  Top 0.254: v66.24,26.21 66.45,26.42 v66.45,46.74
  Bottom 0.254: v66.24,26.21 57.91,26.21 55.88,24.18 SENSE3.5 | v66.45,46.74 67.87,48.16 90.02,48.16 CON1.30
SENSE3_6  (via drill 0.61)
  Top 0.254: v48.36,49.78 48.36,47.55 46.53,45.72 46.53,40.03 46.74,39.83 46.74,31.09 48.16,29.67 48.16,24.18 SENSE3.2
  Bottom 0.254: v48.36,49.78 48.56,49.99 66.45,49.99 66.85,49.58 70.31,49.58 71.32,50.6 88.8,50.6 89.81,49.58 91.44,49.58 92.66,50.8 CON1.31
SENSE3_7  (via drill 0.61)
  Top 0.254: v66.45,24.99 68.68,27.23 68.68,43.89 70.1,45.31 70.1,57.1 73.76,60.76 78.23,60.76 78.23,56.69 79.25,55.68 89,55.68 89,52.83 90.02,51.82 90.02,50.8 CON1.32
  Bottom 0.254: v66.45,24.99 63.8,22.35 55.07,22.35 53.44,23.98 SENSE3.4
SENSE3_OUT
  Bottom 0.254: SENSE21_0.1 18.29,22.35 49.17,22.35 50.8,23.98 SENSE3.3
SENSE4_0  (via drill 0.61)
  Top 0.254: v58.32,73.15 60.76,75.59 60.76,78.84 59.74,79.86 CON2.1
  Bottom 0.254: v58.32,73.15 57.91,73.56 45.92,73.56 45.92,67.46 46.53,66.85 50.39,66.85 52.02,68.48 SENSE4.13
SENSE4_1  (via drill 0.61)
  Top 0.254: v56.49,70.92 57.3,71.73 57.3,74.17 59.54,76.4 59.54,77.42 CON2.2
  Bottom 0.254: v56.49,70.92 51.82,70.92 49.58,68.68 SENSE4.14
SENSE4_2  (via drill 0.61)
  Top 0.254: v55.68,71.93 56.08,72.34 56.08,78.84 57.1,79.86 CON2.3
  Bottom 0.254: v55.68,71.93 50.39,71.93 47.14,68.68 SENSE4.15
SENSE4_3  (via drill 0.61)
  Top 0.254: v53.65,75.59 53.85,75.39 53.85,69.29 54.46,68.68 SENSE4.12
  Bottom 0.254: v53.65,75.59 54.46,76.4 56.08,76.4 CON2.4
SENSE4_4  (via drill 0.61)
  Top 0.254: v65.23,65.02 64.21,66.04 v64.21,77.01
  Bottom 0.254: v65.23,65.02 48.56,65.02 44.5,60.96 SENSE4.1 | v64.21,77.01 60.15,81.08 55.68,81.08 CON2.5
SENSE4_5
  Top 0.254: SENSE4.5 54.66,60.96 55.07,61.37 55.07,66.85 55.68,67.46 55.68,70.51 54.66,71.53 54.66,77.42 CON2.6
SENSE4_6  (via drill 0.61)
  Top 0.254: v42.27,59.13 42.47,59.33 42.47,76.4 43.28,77.22 v43.28,78.64
  Bottom 0.254: v42.27,59.13 45.11,59.13 46.94,60.96 SENSE4.2 | v43.28,78.64 43.28,81.08 51,81.08 CON2.7
SENSE4_7
  Top 0.254: SENSE4.4 52.22,60.96 52.63,61.37 52.63,67.06 53.24,67.67 53.24,74.78 52.22,75.79 52.22,77.42 CON2.8
SENSE4_OUT  (via drill 0.61)
  Top 0.254: v28.25,28.85 28.25,25.6 26.82,24.18 SENSE21_0.5 | v44.91,34.34 45.92,35.36 45.92,52.63 48.36,55.07 48.36,59.33 49.38,60.35 49.38,60.96 SENSE4.3
  Bottom 0.254: v28.25,28.85 29.46,30.07 38.61,30.07 42.88,34.34 v44.91,34.34
SENSE5_0  (via drill 0.61)
  Top 0.254: v53.65,66.85 53.44,66.65 53.44,60.15 52.43,59.13 52.43,56.08 52.22,55.88 SENSE5.13 | v62.38,76.4 v62.38,73.15
  Bottom 0.254: v53.65,66.85 60.15,66.85 61.16,67.87 61.16,73.15 v62.38,73.15 | v62.38,76.4 59.94,78.84 50.6,78.84 49.58,79.86 CON2.9
SENSE5_1
  Top 0.254: CON2.10 50.6,76.4 50.6,59.94 49.99,59.33 49.99,56.29 49.58,55.88 SENSE5.14
SENSE5_2
  Top 0.254: CON2.11 48.16,78.84 48.16,59.94 47.75,59.54 47.75,56.49 47.14,55.88 SENSE5.15
SENSE5_3  (via drill 0.61)
  Top 0.254: v56.08,63.8 56.08,60.35 55.47,59.74 55.47,56.69 54.66,55.88 SENSE5.12 | v58.12,64.01 58.32,64.21 v58.32,70.51 | v47.14,72.54 47.14,77.42 CON2.12
  Bottom 0.254: v56.08,63.8 56.29,64.01 v58.12,64.01 | v58.32,70.51 55.88,72.95 47.55,72.95 v47.14,72.54
SENSE5_4
  Top 0.254: SENSE5.1 44.5,48.36 45.31,49.17 45.31,54.66 45.52,54.86 45.52,78.84 44.5,79.86 CON2.13
SENSE5_5  (via drill 0.61)
  Top 0.254: v19.51,43.48 19.51,65.63 23.16,69.29 v23.16,69.49 | v43.48,73.15 44.3,73.97 44.3,77.42 CON2.14
  Bottom 0.254: v19.51,43.48 49.78,43.48 54.46,48.16 SENSE5.5 | v23.16,69.49 23.57,69.9 40.23,69.9 v43.48,73.15
SENSE5_6
  Bottom 0.254: CON2.15 40.84,81.08 18.49,81.08 14.63,77.22 2.23,77.22 2.23,47.95 3.25,46.94 6.5,46.94 7.52,45.92 20.32,45.92 20.93,45.31 44.09,45.31 46.94,48.16 SENSE5.2
SENSE5_7  (via drill 0.61)
  Top 0.254: v52.83,45.31 52.83,47.55 52.22,48.16 SENSE5.4 | v69.09,45.52 68.48,46.13 68.48,72.34 v65.23,75.59 | v58.52,76.61 58.32,76.81 58.32,80.47 57.71,81.08 43.08,81.08 43.08,79.65 42.06,78.64 42.06,77.62 CON2.16
  Bottom 0.254: v52.83,45.31 53.03,45.52 65.63,45.52 66.04,45.11 68.68,45.11 v69.09,45.52 | v65.23,75.59 65.02,75.39 59.74,75.39 v58.52,76.61
SENSE5_OUT  (via drill 0.61)
  Top 0.254: SENSE21_0.3 20.52,25.2 v20.52,44.5
  Bottom 0.254: v20.52,44.5 20.73,44.7 45.92,44.7 49.38,48.16 SENSE5.3
SENSE6_0
  Top 0.254: CON2.17 38.2,78.84 38.2,77.22 37.39,76.4 37.39,70.51 35.76,68.89 35.76,59.54 38,57.3 SENSE6.13
SENSE6_1  (via drill 0.61)
  Top 0.254: v41.45,75.59 41.45,62.99 38.2,59.74 SENSE6.14
  Bottom 0.254: v41.45,75.59 39.62,77.42 39.42,77.42 CON2.18
SENSE6_2
  Top 0.254: SENSE6.15 38.2,62.38 40.44,64.62 40.44,80.47 39.83,81.08 36.98,81.08 36.98,80.06 CON2.19
SENSE6_3  (via drill 0.61)
  Top 0.254: v36.78,60.96 36.37,61.37 36.37,68.68 38.41,70.71 v38.41,76
  Bottom 0.254: v36.78,60.96 36.37,60.96 36.37,56.29 38,54.66 SENSE6.12 | v38.41,76 36.98,77.42 CON2.20
SENSE6_4
  Top 0.254: SENSE6.1 30.48,64.82 30.68,65.02 30.68,80.47 31.29,81.08 34.14,81.08 34.14,80.06 CON2.21
SENSE6_5  (via drill 0.61)
  Top 0.254: v29.67,75.59 v29.67,67.06
  Bottom 0.254: v29.67,67.06 28.65,67.06 28.65,56.49 30.48,54.66 SENSE6.5 | v29.67,75.59 30.48,76.4 33.12,76.4 34.14,77.42 CON2.22
SENSE6_6
  Top 0.254: CON2.23 32.92,78.84 32.92,77.22 34.34,75.79 34.34,66.24 30.48,62.38 SENSE6.2
SENSE6_7  (via drill 0.61)
  Top 0.254: v32.31,67.67 31.7,68.28 31.7,77.42 CON2.24
  Bottom 0.254: v32.31,67.67 32.31,59.13 30.48,57.3 SENSE6.4
SENSE6_OUT
  Top 0.254: SENSE21_1.12 26.62,16.66 26.21,17.07 26.21,22.35 25.6,22.96 25.6,45.11 28.04,47.55 28.04,57.1 30.48,59.54 SENSE6.3
SENSE7_0
  Top 0.254: SENSE7.13 25.4,57.1 27.23,55.27 27.23,54.25 26.42,53.44 22.96,53.44 22.96,67.26 25.6,69.9 25.6,80.47 26.21,81.08 29.06,81.08 29.06,80.06 CON2.25
SENSE7_1
  Top 0.254: SENSE7.14 25.4,59.74 28.65,62.99 28.65,77.01 29.06,77.42 CON2.26
SENSE7_2
  Top 0.254: CON2.27 27.84,78.84 27.84,64.82 25.4,62.38 SENSE7.15
SENSE7_3
  Top 0.254: SENSE7.12 25.4,54.66 23.57,56.49 23.57,67.06 26.62,70.1 26.62,77.42 CON2.28
SENSE7_4
  Top 0.254: CON2.29 22.96,78.84 22.96,77.22 21.54,75.79 21.54,68.48 17.88,64.82 SENSE7.1
SENSE7_5  (via drill 0.61)
  Top 0.254: v21.95,58.73 22.35,59.13 22.35,67.46 24.18,69.29 24.18,77.42 CON2.30
  Bottom 0.254: v21.95,58.73 17.88,54.66 SENSE7.5
SENSE7_6  (via drill 0.61)
  Top 0.254: v19.51,69.09 19.1,69.49 19.1,76 20.52,77.42 20.52,78.84 21.54,79.86 CON2.31
  Bottom 0.254: v19.51,69.09 19.51,64.01 17.88,62.38 SENSE7.2
SENSE7_7  (via drill 0.61)
  Top 0.254: v16.05,75.59 16.05,58.93 17.68,57.3 SENSE7.4
  Bottom 0.254: v16.05,75.59 16.87,76.4 20.52,76.4 CON2.32
SENSE7_OUT  (via drill 0.61)
  Top 0.254: SENSE21_1.13 23.57,17.07 23.57,22.55 22.76,23.37 22.76,52.83 20.52,55.07 v20.52,58.52
  Bottom 0.254: v20.52,58.52 19.51,59.54 17.88,59.54 SENSE7.3
SENSE_INHIBIT  (via drill 0.61)
  Top 0.254: SENSE6.6 30.48,52.02 28.65,50.19 28.65,41.66 29.26,41.05 29.26,33.93 28.04,32.72 28.04,30.28 29.26,29.06 29.26,24.18 SENSE21_0.6 28.04,22.96 28.04,10.57 29.06,9.55 29.06,8.94 SENSE21_1.6 29.26,8.74 30.48,7.52 JP4.9 30.48,2.44 31.7,1.22 55.88,1.22 55.88,6.3 58.32,8.74 SENSE2.6 58.32,8.94 57.3,9.96 v57.3,14.02 57.3,22.55 58.32,23.57 58.32,23.98 SENSE3.6 58.32,24.18 57.91,24.59 57.91,30.07 57.3,30.68 v57.3,44.5 57.3,48.16 SENSE5.6 57.1,48.36 56.08,49.38 56.08,56.9 56.69,57.51 56.69,60.55 57.1,60.96 SENSE4.6
  Bottom 0.254: SENSE7.6 17.88,52.22 18.9,53.24 29.46,53.24 30.48,52.22 SENSE6.6 | v57.3,14.02 72.34,14.02 SENSE0.6 | v57.3,44.5 72.34,44.5 SENSE1.6
SG0_OUT  (via drill 0.61)
  Top 0.254: v40.44,27.84 41.86,26.42 41.86,2.64 JP1.1
  Bottom 0.254: v40.44,27.84 25.6,27.84 21.74,31.7 SENSE21_0.14
SG1_OUT  (via drill 0.61)
  Top 0.254: v42.88,20.32 42.88,4.06 44.3,2.64 JP1.2
  Bottom 0.254: v42.88,20.32 41.66,21.54 15.44,21.54 15.44,25.2 16.05,25.81 18.9,25.81 18.9,31.7 SENSE21_0.15
SG2_OUT  (via drill 0.61)
  Top 0.254: v28.04,5.89 28.04,9.75 25.6,12.19 25.6,17.27 24.99,17.88 24.99,23.16 24.18,23.98 SENSE21_0.4
  Bottom 0.254: v28.04,5.89 30.07,3.86 45.72,3.86 46.94,2.64 JP1.3
SG3_OUT  (via drill 0.61)
  Top 0.254: v43.89,13.21 44.7,12.39 44.7,7.32 49.38,2.64 JP1.4
  Bottom 0.254: v43.89,13.21 41.86,15.24 39.01,15.24 38.61,14.83 23.37,14.83 21.74,16.46 SENSE21_1.14
TOGGLE_IN
  Top 0.254: JP2.1 3.86,69.9 3.86,72.34 JP2.2 3.86,72.54 6.71,75.39 6.71,82.5 60.55,82.5 69.09,73.97 69.09,71.12 89,71.12 92.66,67.46 R2.P$1
VDD  (via drill 0.61)
  Top 0.61: C5.2 38,27.84 38,15.24 39.22,14.02 C6.2 | JP4.1 10.16,2.64 9.55,3.25 9.55,10.16 8.74,10.97 8.74,12.39 10.16,13.82 C10.2 | J1.3 10.16,47.55 C9.2 | SENSE21_1.16 17.68,17.68 17.68,30.68 16.66,31.7 SENSE21_0.16 | SENSE4.16 44.3,68.48 43.28,67.46 43.28,56.9 44.3,55.88 SENSE5.16 44.09,55.68 43.28,54.86 43.28,34.34 45.72,31.9 SENSE3.16 | v33.33,68.89 33.33,70.92 33.12,71.12 C8.2 | SENSE1.16 79.05,58.12 79.05,61.98 77.62,63.4 C2.2 | v77.62,28.45 77.62,32.92 C1.2 77.42,33.12 v77.42,40.64 | K1.1 63.6,40.64 63.6,51.82 v64.82,53.03 64.62,53.24 64.62,62.79 66.24,64.41 66.24,65.02 67.26,66.04 C3.2
  Bottom 0.61: SENSE2.16 45.72,12.19 41.05,12.19 39.42,13.82 C6.2 39.22,14.02 14.43,14.02 14.22,14.22 | SENSE3.16 45.72,31.7 43.28,29.26 39.42,29.26 C5.2 | 14.22,14.22 14.02,14.02 10.16,14.02 C10.2 | 14.22,14.22 SENSE21_1.16 | SENSE21_0.16 14.02,29.26 10.16,29.26 C9.2 | C7.2 20.32,69.9 25.4,64.82 SENSE7.16 25.6,65.02 29.26,68.68 33.12,68.68 v33.33,68.89 37.19,65.02 38,65.02 SENSE6.16 38.2,64.82 41.86,68.48 44.3,68.48 SENSE4.16 44.5,68.28 44.5,65.84 64.41,65.84 64.62,66.04 C3.2 67.46,66.04 68.68,64.82 76.2,64.82 77.42,63.6 C2.2 | SENSE0.16 78.23,28.45 v77.62,28.45 | v64.82,53.03 67.06,53.03 67.26,53.24 C4.2 | K1.1 v77.42,40.64
VDD2  (via drill 0.61)
  Top 0.813: JP3.9 JP3.7 JP3.5 JP3.3 JP3.1 84.12,81.08 88.8,76.4 88.8,72.54 C14.1 | J1.5 15.04,70.51 v15.04,73.56
  Bottom 0.813: 80.06,71.12 81.28,72.34 C13.1 | 80.06,71.12 79.86,70.92 75.18,70.92 73.76,72.34 C15.1 73.36,72.54 71.53,74.37 15.85,74.37 v15.04,73.56 | C14.1 88.8,72.34 87.38,70.92 80.26,70.92 80.06,71.12
VDD_33  (via drill 0.61)
  Top 0.61: U$1.P5 3.86,13.41 5.69,13.41 5.69,29.46 4.27,30.89 3.86,30.89 U$3.P5 | R2.P$2 94.69,57.71 94.69,10.36 v91.85,7.52
  Bottom 0.61: 48.16,6.5 47.75,6.91 11.38,6.91 5.08,13.21 3.86,13.21 U$1.P5 | 48.16,6.5 52.02,2.64 JP1.5 | v91.85,7.52 91.44,7.11 64.21,7.11 63.8,6.71 48.36,6.71 48.16,6.5

### Text on the board
tPlace: vdd2 | gnd2 | select_gnd | select_in | select_out | gnd2 | vdd2 | gnd | vdd | sense_gnd | sense_5v | NES0 | NES1 | s0 | s1 | s2 | s3 | VDD | GND | CLK0 | CLK0 | LCH0 | DAT0 | CLK1 | LCH1 | DAT1 | SINH | AREN | SNS0 | SNS1 | SNS2 | SNS3 | VD33 | v1.0